# EAGLE design killswitch (EAGLE 8.4.3)
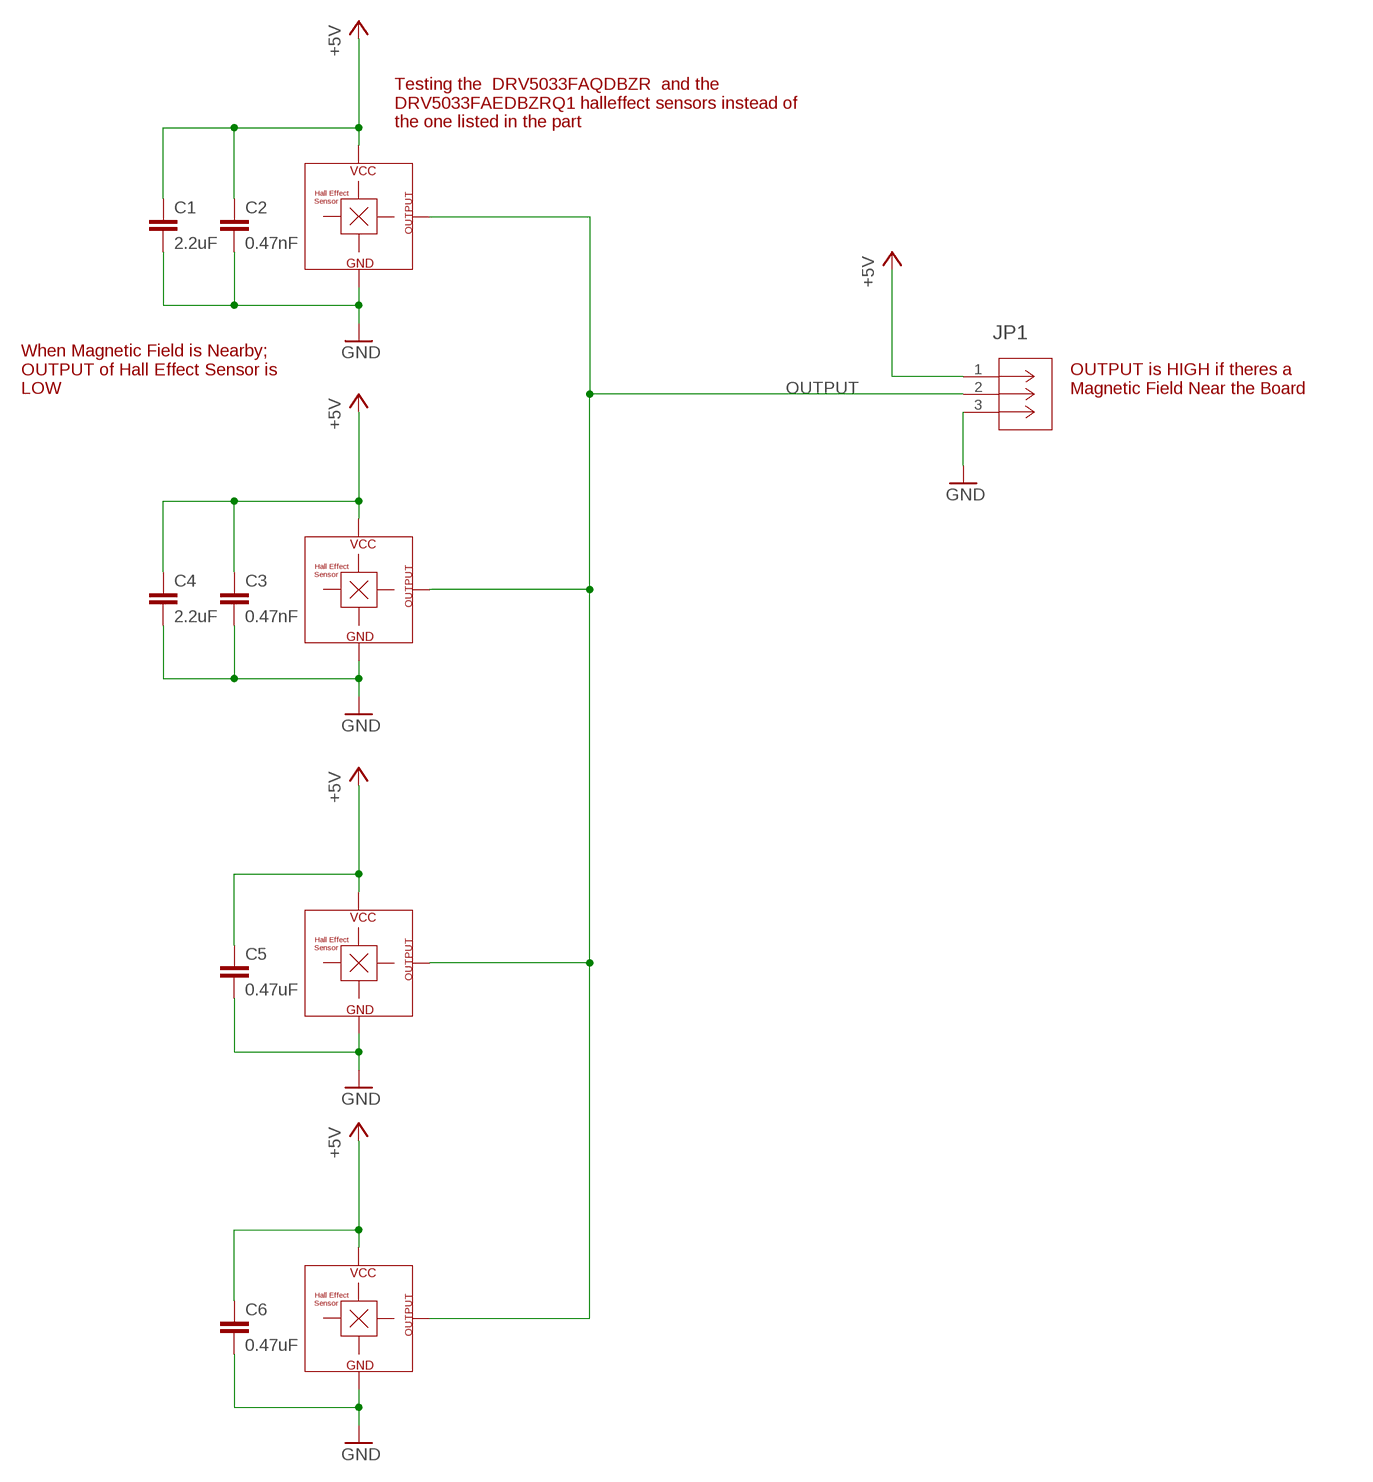
[diagram p0: schematic, sheet 1]

## Parts
C1  2.2uF  C-EUC0805  [C0805]
C2  0.47nF  C-EUC0603  [C0603]
C3  0.47nF  C-EUC0603  [C0603]
C4  2.2uF  C-EUC0805  [C0805]
C5  0.47uF  C-EUC0603  [C0603]
C6  0.47uF  C-EUC0603  [C0603]
JP1  1241150-3  [CONN_1241150-3_TYCO]
U$1  TCS40DLR  [SOT23]
U$3  TCS40DLR  [SOT23]
U$4  TCS40DLR  [SOT23]
U$5  TCS40DLR  [SOT23]

## Nets
+5V: C1.1 C2.1 C3.1 C4.1 C5.1 C6.1 JP1.1 U$1.VCC U$3.VCC U$4.VCC U$5.VCC
GND: C1.2 C2.2 C3.2 C4.2 C5.2 C6.2 JP1.3 U$1.GND U$3.GND U$4.GND U$5.GND
OUTPUT: JP1.2 U$1.OUTPUT U$3.OUTPUT U$4.OUTPUT U$5.OUTPUT

## Notes on the sheet
- Testing the  DRV5033FAQDBZR  and the  
  DRV5033FAEDBZRQ1 halleffect sensors instead of
  the one listed in the part
- When Magnetic Field is Nearby;
  OUTPUT of Hall Effect Sensor is
  LOW
- OUTPUT is HIGH if theres a
  Magnetic Field Near the Board

## Library data of the parts
C1-C6 = resistor:C-EU: CAPACITOR, European symbol
JP1 = KillSwitch:1241150-3; MANUFACTURER_PART_NUMBER: 12411503; VENDOR: Tyco Electronics
U$1 U$3-U$5 = KillSwitch:TCS40DLR

## Board
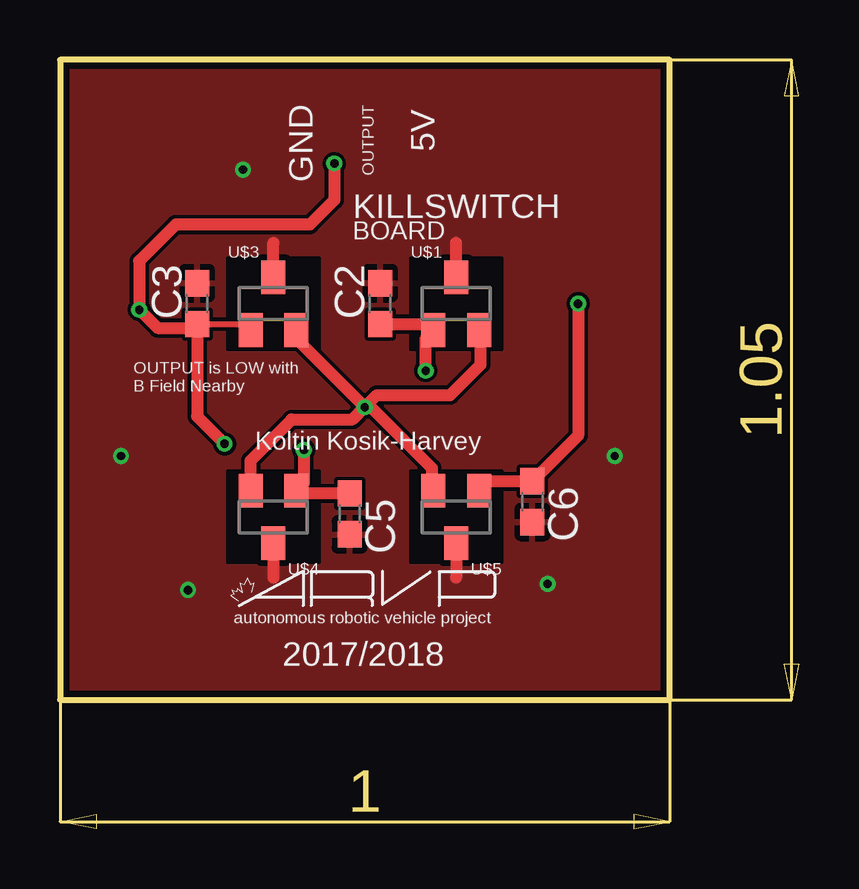
[diagram p1: board, top side]
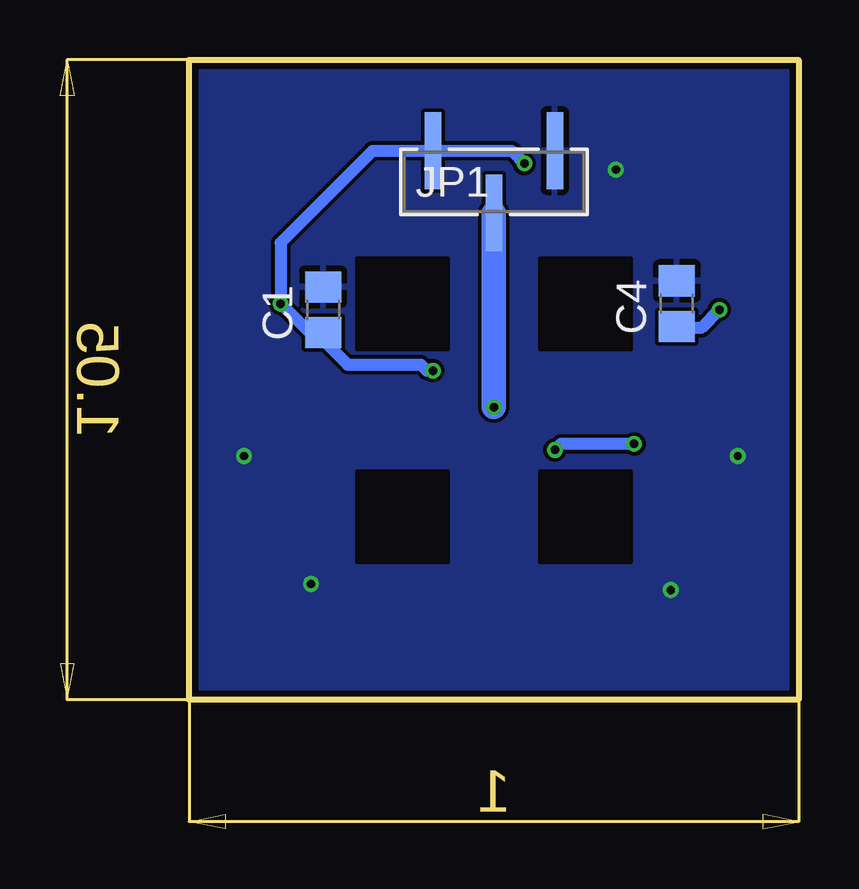
[diagram p2: board, bottom side, seen from below]

Size 25.4 x 26.67 mm. Coordinates in mm from the lower left corner, seen from the top.
Outline: 0,26.67 0,0 25.4,0 25.4,26.67 0,26.67
Copper layers (1*16): Top 0.035mm / dielectric 1.5mm / Bottom 0.035mm
Design rules "SeeedStudio_2layer_DRU_no_angle_20140221": minimum track width 6mil, minimum drill 12mil, track to track 6mil, track to pad 6mil, pad to pad 6mil, via to via 6mil, smd to smd 0mil, copper to edge 10mil, drill to drill 10mil, minimum pad ring 10mil, minimum via ring 6mil, stop-mask expansion 2mil, vias tented up to drill 100mil, thermal gap 10mil
Milling: 4 lines

### Footprints (pad centres in the part's own frame; a part is rotated, then mirrored left to right if it is on the bottom)
C0805 = smd 1.3 x 1.5: 1 -0.95,0; 2 0.95,0
C0603 = smd 1.1 x 1: 1 -0.85,0; 2 0.85,0
CONN_1241150-3_TYCO = smd 0.686 x 3.2: 1 -2.54,1.295; 2 0,-1.295; 3 2.54,1.295
SOT23 = smd 1 x 1.4: GND 0,1.1; OUTPUT 0.95,-1.1; VCC -0.95,-1.1

### Placement (x,y rotation side)
C1  19.81,16.26 90 bottom
C2  13.33,16.51 90 top
C3  5.71,16.51 90 top
C4  5.08,16.51 90 bottom
C5  12.06,7.75 270 top
C6  19.68,8.25 270 top
JP1  12.7,21.59 0 bottom
U$1  16.51,16.51 0 top
U$2  [LOGO2]  7.24,3.17 0 top
U$3  8.89,16.51 0 top
U$4  8.89,7.62 180 top
U$5  16.51,7.62 180 top

### Tracks (layer width: path | path; a pad name or v marks a point on that pad's centre or on a via)
+5V  (via drill 0.35)
  Top 0.254: 10.22,9.1 10.16,9.04 U$4.VCC 9.96,8.6 | 17.84,9.1 U$5.VCC | 5.55,15.49 C3.1 7.69,15.66 U$3.VCC | 15.24,15.09 U$1.VCC 15.31,15.66
  Top 0.508: v21.59,16.51 21.59,11.01 C6.1 17.84,9.1 | v11.43,22.35 11.43,20.83 10.41,19.81 4.83,19.81 3.3,18.29 v3.3,16.26 4.06,15.49 5.55,15.49 | v15.24,13.72 15.24,15.09 | v10.16,10.41 10.16,9.04 | C5.1 9.96,8.6 | C3.1 5.71,11.81 v6.86,10.67 | C2.1 15.31,15.66
  Bottom 0.254: 20.32,15.24 19.88,15.24 C1.1 19.81,14.99 | 5.01,15.49 C4.1 | 15.49,13.72 v15.24,13.72
  Bottom 0.508: 20.32,15.24 v21.59,16.51 21.59,19.05 17.75,22.88 JP1.1 11.96,22.88 v11.43,22.35 | v3.3,16.26 4.06,15.49 5.01,15.49 | 19.81,14.99 18.8,13.97 15.75,13.97 15.49,13.72 | v6.86,10.67 9.91,10.67 v10.16,10.41
GND  (via drill 0.35)
  Top 0.508: U$1.GND 16.51,19.05 | U$3.GND 8.89,19.05 | U$4.GND 8.89,5.08 | U$5.GND 16.51,5.08
  other vias: 2.54,10.16 5.33,4.57 20.32,4.83 23.11,10.16 7.62,22.1
  pour Top (rank 2): -10.16,35.56 35.56,35.56 35.56,-8.89 -10.16,-8.89
  pour Bottom (rank 2): -11.43,36.83 36.83,36.83 36.83,-10.16 -11.43,-10.16
N$4
  cutout Bottom: 6.98,9.52 10.79,9.52 10.79,5.71 6.98,5.71
  cutout Bottom: 6.98,18.41 10.79,18.41 10.79,14.6 6.98,14.6
  cutout Bottom: 14.6,18.41 18.41,18.41 18.41,14.6 14.6,14.6
  cutout Bottom: 14.6,9.52 18.41,9.52 18.41,5.71 14.6,5.71
N$7
  cutout Top: 6.98,9.52 10.79,9.52 10.79,5.71 6.98,5.71
  cutout Top: 6.98,18.41 10.79,18.41 10.79,14.6 6.98,14.6
  cutout Top: 14.6,18.41 18.41,18.41 18.41,14.6 14.6,14.6
  cutout Top: 14.6,9.52 18.41,9.52 18.41,5.71 14.6,5.71
OUTPUT  (via drill 0.35)
  Top 0.254: 17.41,15.36 17.27,15.22 | 17.41,15.36 U$1.OUTPUT | 17.53,15.24 17.41,15.36 | U$3.OUTPUT 9.84,15.05 | v12.7,12.19 12.95,12.19 | 15.49,8.79 U$5.OUTPUT
  Top 0.508: U$4.OUTPUT 7.94,9.97 9.65,11.68 12.19,11.68 v12.7,12.19 | 17.53,15.24 17.53,13.97 16.26,12.7 13.21,12.7 v12.7,12.19 | 9.84,15.05 v12.7,12.19 | 12.95,12.19 15.49,9.65 15.49,8.79
  Bottom 1.016: JP1.2 v12.7,12.19

### Text on the board
tPlace: 5V | GND | OUTPUT | KILLSWITCH | BOARD | OUTPUT is LOW with / B Field Nearby | Koltin Kosik-Harvey | 2017/2018